# Altium project OL_sensor_assy FPC.PrjPCB
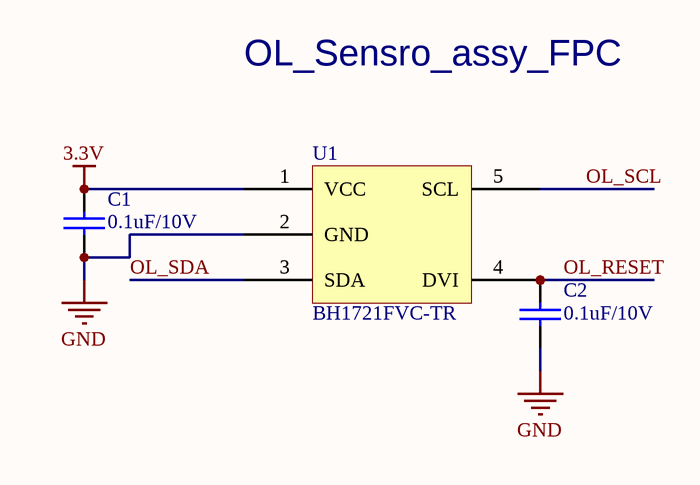
[diagram p0: OL_sensor_assy FPC.SchDoc]
1 sheet, 3 parts. Net scope: global (net labels, ports and power ports of the same name join across sheets).
Board file: OL_sensor_assy FPC.PcbDoc

## Sheet OL_sensor_assy FPC.SchDoc
size A4

### Parts
C1  0.1uF/10V  [0402C]
C2  0.1uF/10V  [0402C]
U1  BH1721FVC-TR  [WSOF5]

### Nets
3.3V: C1.1 U1.1(VCC)
GND: C1.2 C2.2 U1.2(GND)
OL_RESET: C2.1 U1.4(DVI)
OL_SCL: U1.5(SCL)
OL_SDA: U1.3(SDA)

### Notes on the sheet
- OL_Sensro_assy_FPC

### Library data of the parts
C1 C2 = CAP: 厂家：Murata，型号：